# EasyEDA schematic 1-Schematic_HF Upconverter (SMD, ENCLOSURE).json

## Sheets
1 HF Upconverter (SMD, ENCLOSURE): Mixer with filters: TITLE: HF Upconverter (SMD, ENCLOSURE): Mixer with filters; REV: 1.0.EE; Date: 2020-04-14; Sheet: 2/2; Drawn By: IgrikXD; Company: Easy-SDR
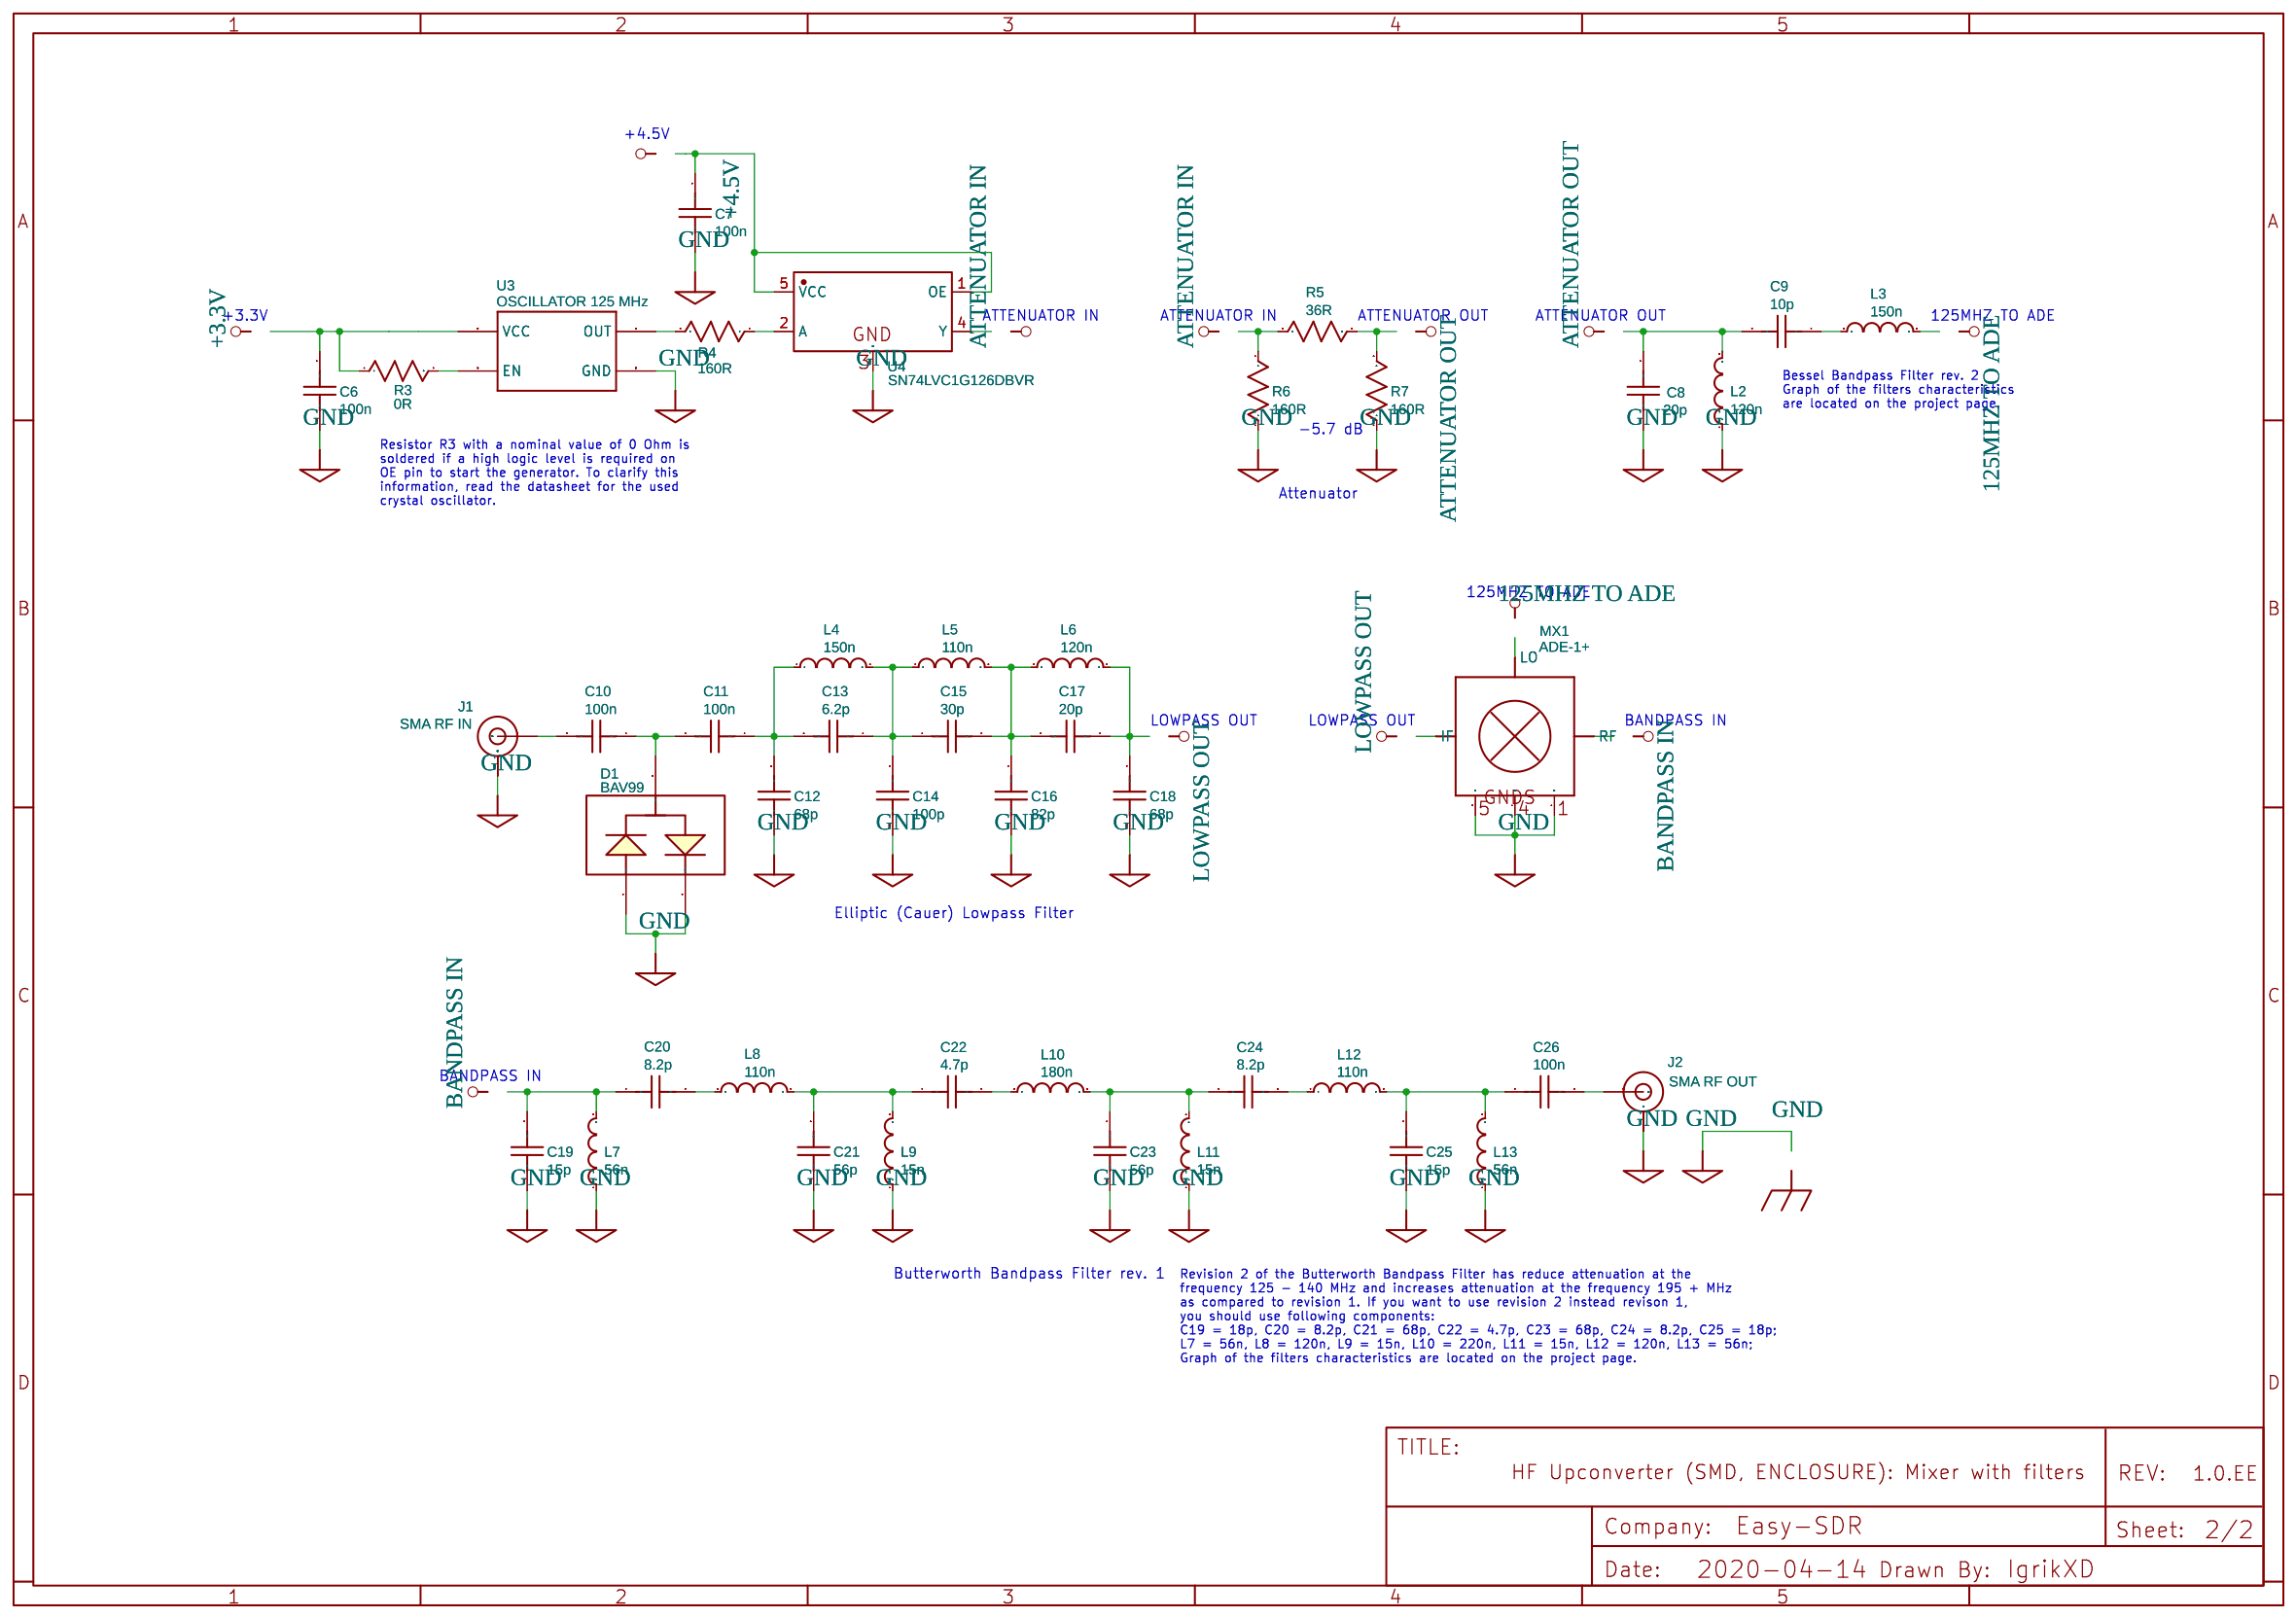
[diagram p0: HF Upconverter (SMD, ENCLOSURE): Mixer with filters]
2 HF Upconverter (SMD, ENCLOSURE): Power circuit: TITLE: HF Upconverter (SMD, ENCLOSURE): Power circuit; Sheet: 1/2
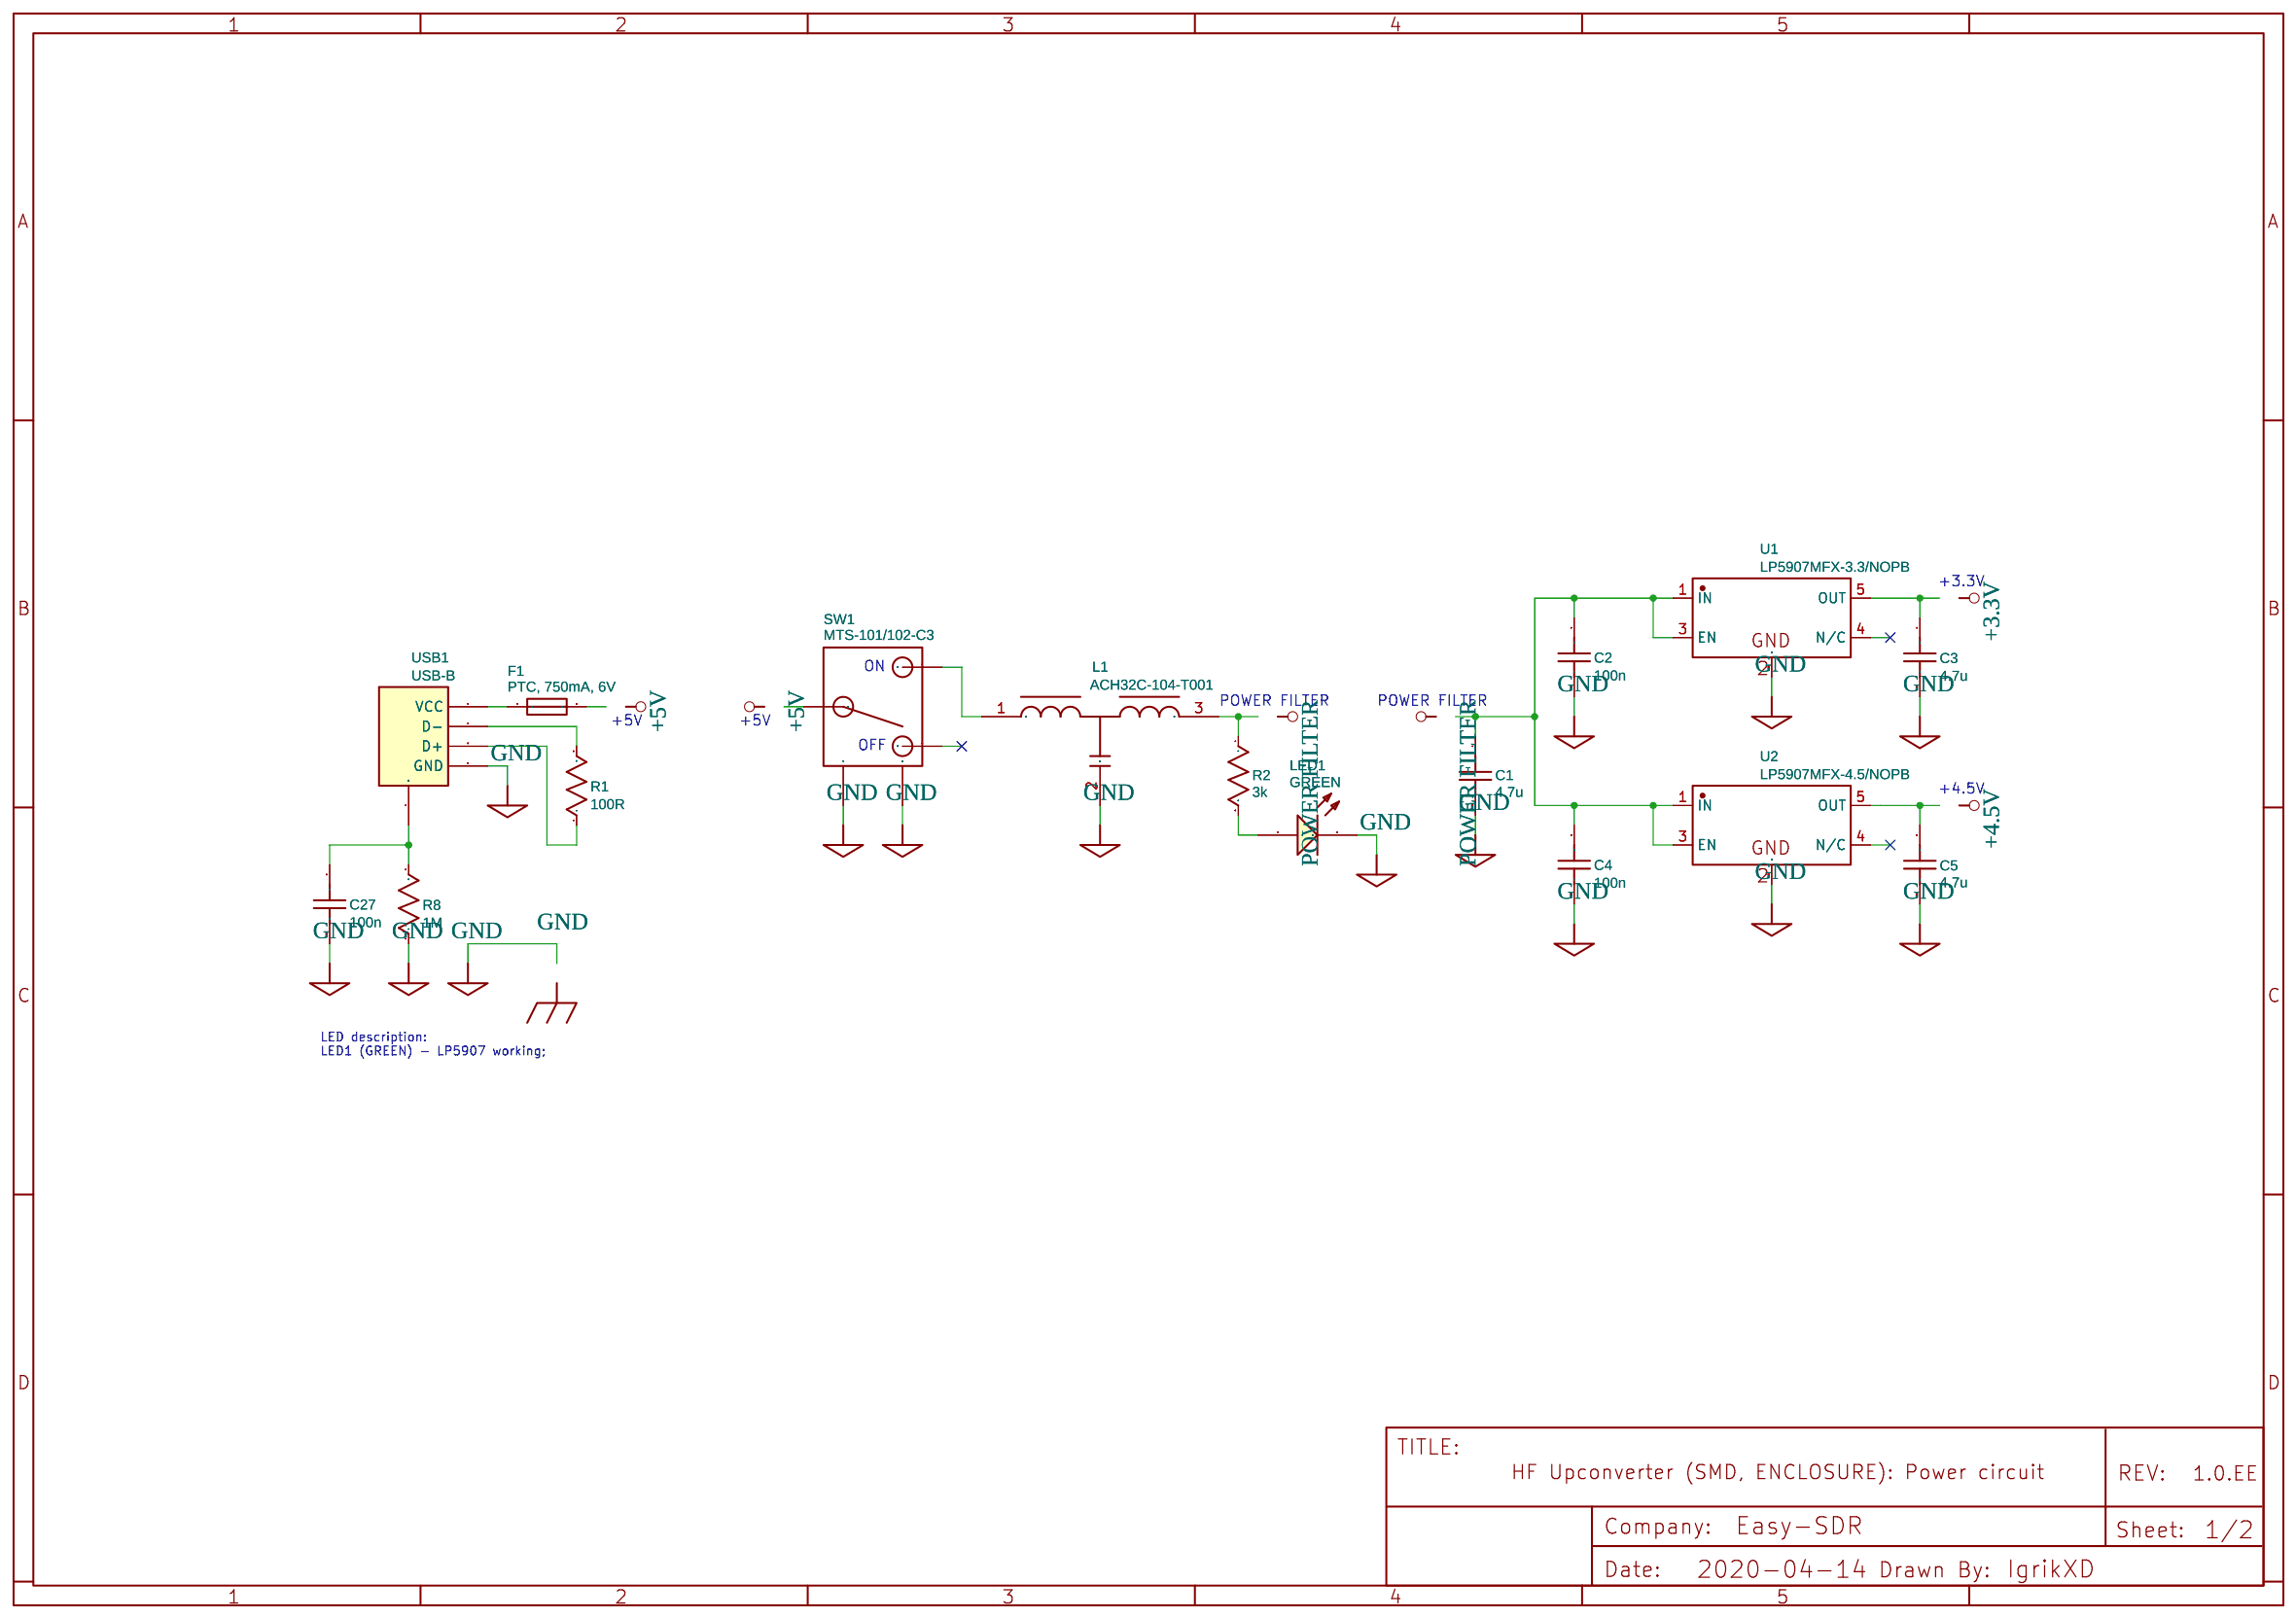
[diagram p1: HF Upconverter (SMD, ENCLOSURE): Power circuit]

## Parts
sheet HF Upconverter (SMD, ENCLOSURE): Mixer with filters
C6  100n  [0805]
C7  100n  [0805]
C8  20p  [0805 WITHOUT MASK]
C9  10p  [0805 WITHOUT MASK]
C10  100n  [0805 WITHOUT MASK]
C11  100n  [0805 WITHOUT MASK]
C12  68p  [0805 WITHOUT MASK]
C13  6.2p  [0805 WITHOUT MASK]
C14  100p  [0805 WITHOUT MASK]
C15  30p  [0805 WITHOUT MASK]
C16  82p  [0805 WITHOUT MASK]
C17  20p  [0805 WITHOUT MASK]
C18  68p  [0805 WITHOUT MASK]
C19  15p  [0805 WITHOUT MASK]
C20  8.2p  [0805 WITHOUT MASK]
C21  56p  [0805 WITHOUT MASK]
C22  4.7p  [0805 WITHOUT MASK]
C23  56p  [0805 WITHOUT MASK]
C24  8.2p  [0805 WITHOUT MASK]
C25  15p  [0805 WITHOUT MASK]
C26  100n  [0805 WITHOUT MASK]
D1  BAV99  [SOT-23-3 WITHOUT MASK]
J1  SMA RF IN  [SMA-EDGE]
J2  SMA RF OUT  [SMA-EDGE]
L2  120n  [0805 WITHOUT MASK]
L3  150n  [0805 WITHOUT MASK]
L4  150n  [0805 WITHOUT MASK]
L5  110n  [0805 WITHOUT MASK]
L6  120n  [0805 WITHOUT MASK]
L7  56n  [0805 WITHOUT MASK]
L8  110n  [0805 WITHOUT MASK]
L9  15n  [0805 WITHOUT MASK]
L10  180n  [0805 WITHOUT MASK]
L11  15n  [0805 WITHOUT MASK]
L12  110n  [0805 WITHOUT MASK]
L13  56n  [0805 WITHOUT MASK]
MX1  ADE-1+  [CD636 WITHOUT MASK]
R3  0R  [0805]
R4  160R  [0805 WITHOUT MASK]
R5  36R  [0805 WITHOUT MASK]
R6  160R  [0805 WITHOUT MASK]
R7  160R  [0805 WITHOUT MASK]
U3  OSCILLATOR 125 MHz  [CRYSTAL-SMD-7X5]
U4  SN74LVC1G126DBVR  [SOT-23-5 WITHOUT MASK]
sheet HF Upconverter (SMD, ENCLOSURE): Power circuit
C1  4.7u  [0805]
C2  100n  [0805]
C3  4.7u  [0805]
C4  100n  [0805]
C5  4.7u  [0805]
C27  100n  [0805]
F1  PTC, 750mA, 6V  [0805]
L1  ACH32C-104-T001  [FILTER-SMD_3P-L3.2-W1.6_ACH32C]
LED1  GREEN  [LED-0805]
R1  100R  [0805]
R2  3k  [0805]
R8  1M  [0805]
SW1  MTS-101/102-C3  [MTS-102-C3]
U1  LP5907MFX-3.3/NOPB  [SOT-23-5]
U2  LP5907MFX-4.5/NOPB  [SOT-23-5]
USB1  USB-B  [USB TYPE B]

## Library data of the parts
C2 C4 C6 C7 C10 C11 C26 C27 = Capacitor: Manufacturer Part: 0805B104J250; Supplier: LCSC; Manufacturer: Walsin Tech Corp; Supplier Part: C163184
C8 C17 = Capacitor: Manufacturer Part: 0805CG200J500NT; Supplier: LCSC; Manufacturer: FH; Supplier Part: C94472
C9 = Capacitor: Manufacturer Part: 0805N100J500; Supplier: LCSC; Manufacturer: WTC; Supplier Part: C123640
C12 C18 = Capacitor: Supplier: LCSC; Manufacturer: WTC; Manufacturer Part: 0805N680J500; Supplier Part: C123650
C13 = Capacitor: Manufacturer Part: 0805CG6R2C500NT; Supplier: LCSC; Manufacturer: FH; Supplier Part: C1831
C14 = Capacitor: Manufacturer Part: C2012C0G2A101JT000N; Supplier: LCSC; Manufacturer: TDK; Supplier Part: C76633
C15 = Capacitor: Manufacturer Part: CC0805JRNPO9BN300; Supplier: LCSC; Manufacturer: YAGEO; Supplier Part: C107114
C16 = Capacitor: Manufacturer Part: 0805CG820J500NT; Supplier: LCSC; Manufacturer: FH; Supplier Part: C1841
C19 = Capacitor: Supplier: LCSC; Manufacturer: SAMSUNG; Manufacturer Part: CL21C150JBANNNC; Supplier Part: C1794
C20 = Capacitor: Supplier: LCSC; Manufacturer: FH; Manufacturer Part: 0805CG8R2C500NT; Supplier Part: C1840
C21 C23 = Capacitor: Manufacturer Part: 0805CG560J500NT; Supplier: LCSC; Manufacturer: FH; Supplier Part: C1828
C22 = Capacitor: Manufacturer Part: 0805CG4R7C500NT; Supplier: LCSC; Manufacturer: FH; Supplier Part: C1820
C24 = Capacitor: Manufacturer Part: 0805CG8R2C500NT; Supplier: LCSC; Manufacturer: FH; Supplier Part: C1840
C25 = Capacitor: Manufacturer Part: CL21C150JBANNNC; Supplier: LCSC; Manufacturer: SAMSUNG; Supplier Part: C1794
D1 = -: Supplier: LCSC; Manufacturer: SEMTECH; Contributor: IgrikXD; Supplier Part: C83868
J1 J2 = -: Contributor: IgrikXD; Manufacturer Part: ANKX01.0093; Supplier: LCSC; Supplier Part: C129604; Manufacturer: RFsister
L2 L6 = Inductor: Manufacturer Part: BKW0805UCR12JGT; Supplier: LCSC; Manufacturer: FH-BK; Supplier Part: C98546
L3 L4 = Inductor: Manufacturer Part: BKW0805UCR15JGT; Supplier: LCSC; Manufacturer: FH-BK; Supplier Part: C107465
L5 L8 L12 = Inductor: Manufacturer Part: LQW18ANR11G00D; Supplier: LCSC; Manufacturer: MuRata; Supplier Part: C113130
L7 = Inductor: Supplier: LCSC; Manufacturer: FH-BK; Manufacturer Part: BKW0805UC056JGT; Supplier Part: C98534
L9 = Inductor: Supplier: LCSC; Manufacturer Part: BKW0805UC015JGT; Manufacturer: FH-BK; Supplier Part: C107468
L10 = Inductor: Manufacturer Part: BKW0805UCR18JGT; Supplier: LCSC; Manufacturer: FH-BK; Supplier Part: C107466
L11 = Inductor: Manufacturer Part: BKW0805UC015JGT; Supplier: LCSC; Manufacturer: FH-BK; Supplier Part: C107468
L13 = Inductor: Manufacturer Part: BKW0805UC056JGT; Supplier: LCSC; Manufacturer: FH-BK; Supplier Part: C98534
MX1 = -: Manufacturer Part: ADE-1; Supplier: Mini-Circuits; Supplier Part: ADE-1; Manufacturer: Mini-Circuits; link: https://www.minicircuits.com/WebStore/dashboard.html?model=ADE-1; Contributor: IgrikXD
R1 R3 = Resistor: Manufacturer Part: RTT051000FTP; Supplier: LCSC; Manufacturer: RALEC; Supplier Part: C103902
R4 R6 R7 = Resistor: Manufacturer Part: CR0805F81600G; Supplier: LCSC; Manufacturer: LIZ; Supplier Part: C101494
R5 = Resistor: Manufacturer Part: RTT0536R0FTP; Supplier: LCSC; Manufacturer: RALEC; Supplier Part: C104270
U3 = -: catid: 20; Contributor: SparkFun; Manufacturer Part: X1G004491000200; Supplier: LCSC; Manufacturer: Seiko Epson; Supplier Part: C70533
U4 = SN74LVC1G126DBVR: Supplier: LCSC; Supplier Part: C7834; Manufacturer: Texas Instruments; Contributor: IgrikXD
C1 C3 C5 = Capacitor: Manufacturer Part: CL21A475KOFNNNE; Supplier: LCSC; Manufacturer: Samsung Electro-Mechanics; Supplier Part: C1746
F1 = -: Supplier: LCSC; Supplier Part: C116173; Manufacturer: BOURNS; Manufacturer Part: MF-PSMF075X-2; Contributor: LCSC
L1 = ACH32C-104-T001: Supplier: LCSC; Manufacturer: TDK; Supplier Part: C20540
LED1 = -: Supplier: LCSC; Manufacturer: Foshan NationStar Optoelectronics; Manufacturer Part: NCD0805G1; Supplier Part: C84260
R2 = Resistor: Manufacturer Part: RTT05302JTP; Supplier: LCSC; Manufacturer: RALEC; Supplier Part: C104211
R8 = Resistor: Manufacturer Part: RC0805FR-071ML; Supplier: LCSC; Manufacturer: YAGEO; Supplier Part: C107700
SW1 = -: Contributor: snhunter; sourceId: LjTecMmIi; Manufacturer Part: NULL; Supplier: Ebay; Manufacturer: NULL
U1 = -: Supplier: LCSC; Supplier Part: C80670; Manufacturer: Texas Instruments; Contributor: IgrikXD
U2 = -: Supplier: Digi-Key; Supplier Part: 296-39064-1-ND; Manufacturer: Texas Instruments; Contributor: IgrikXD
USB1 = -: Supplier Part: C46392; Supplier: LCSC; Manufacturer: Jing Extension of the Electronic Co.; Manufacturer Part: C46392

## Nets
+3.3V: C3.2 C6.2 R3.1 U1.5(OUT) U3.P$4(VCC)
+4.5V: C5.2 C7.2 U2.5(OUT) U4.1(OE) U4.5(VCC)
+5V: F1.2 SW1.2
GND: C1.2 C2.1 C3.1 C4.1 C5.1 C6.1 C7.1 C8.1 C12.1 C14.2 C16.1 C18.1 C19.1 C21.1 C23.1 C25.1 C27.1 D1.1 D1.2 J1.GND@0(GND) J1.GND@1(GND) J1.GND@2(GND) J1.GND@3(GND) J2.GND@0(GND) J2.GND@1(GND) J2.GND@2(GND) J2.GND@3(GND) L1.2 L2.1 L7.1 L9.1 L11.1 L13.1 LED1.2(C) MX1.1(GND) MX1.4(GND) MX1.5(GND) R6.1 R7.1 R8.1 SW1.4 SW1.5 U1.2(GND) U2.2(GND) U3.P$2(GND) U4.3(GND) USB1.2(GND)
125MHZ TO ADE: L3.2 MX1.6(LO)
ATTENUATOR IN: R5.1 R6.2 U4.4(Y)
ATTENUATOR OUT: C8.2 C9.2 L2.2 R5.2 R7.2
BANDPASS IN: C19.2 C20.1 L7.2 MX1.3(RF)
LOWPASS OUT: C17.1 C18.2 L6.2 MX1.2(IF)
POWER FILTER: C1.1 C2.2 C4.2 L1.3 R2.1 U1.1(IN) U1.3(EN) U2.1(IN) U2.3(EN)
Net-(C9-1): C9.1 L3.1
Net-(C10-1): C10.1 C11.2 D1.3
Net-(C10-2): C10.2 J1.SIG(SIGNAL)
Net-(C11-1): C11.1 C12.2 C13.2 L4.1
Net-(C13-1): C13.1 C14.1 C15.1 L4.2 L5.1
Net-(C15-2): C15.2 C16.2 C17.2 L5.2 L6.1
Net-(C20-2): C20.2 L8.1
Net-(C21-2): C21.2 C22.1 L8.2 L9.2
Net-(C22-2): C22.2 L10.1
Net-(C23-2): C23.2 C24.1 L10.2 L11.2
Net-(C24-2): C24.2 L12.1
Net-(C25-2): C25.2 C26.1 L12.2 L13.2
Net-(C26-2): C26.2 J2.SIG(SIGNAL)
Net-(C27-2): C27.2 R8.2 USB1.5(CASE)
Net-(F1-1): F1.1 USB1.1(VCC)
Net-(L1-1): L1.1 SW1.1
Net-(LED1-1): LED1.1(A) R2.2
Net-(R1-1): R1.1 USB1.3(D+)
Net-(R1-2): R1.2 USB1.4(D-)
Net-(R3-2): R3.2 U3.P$1(EN)
Net-(R4-1): R4.1 U4.2(A)
Net-(R4-2): R4.2 U3.P$3(OUT)

Not connected (* = marked no-connect by the designer): SW1 3; U1 4(N/C); U2 4(N/C)

## Notes on the sheets
sheet 1
- +4.5V
- +3.3V
- ATTENUATOR IN
- ATTENUATOR IN
- ATTENUATOR OUT
- ATTENUATOR OUT
- 125MHZ TO ADE
- Bessel Bandpass Filter rev. 2
  Graph of the filters characteristics
  are located on the project page.
- Resistor R3 with a nominal value of 0 Ohm is
  soldered if a high logic level is required on
  OE pin to start the generator. To clarify this
  information, read the datasheet for the used
  crystal oscillator.
- -5.7 dB
- Attenuator
- 125MHZ TO ADE
- LOWPASS OUT
- LOWPASS OUT
- BANDPASS IN
- Elliptic (Cauer) Lowpass Filter
- BANDPASS IN
- Butterworth Bandpass Filter rev. 1
- Revision 2 of the Butterworth Bandpass Filter has reduce attenuation at the
  frequency 125 - 140 MHz and increases attenuation at the frequency 195 + MHz
  as compared to revision 1. If you want to use revision 2 instead revison 1,
  you should use following components:
  C19 = 18p, C20 = 8.2p, C21 = 68p, C22 = 4.7p, C23 = 68p, C24 = 8.2p, C25 = 18p;
  L7 = 56n, L8 = 120n, L9 = 15n, L10 = 220n, L11 = 15n, L12 = 120n, L13 = 56n;
  Graph of the filters characteristics are located on the project page.
sheet 2
- +3.3V
- ON
- POWER FILTER
- POWER FILTER
- +5V
- +5V
- OFF
- +4.5V
- LED description:
  LED1 (GREEN) - LP5907 working;
